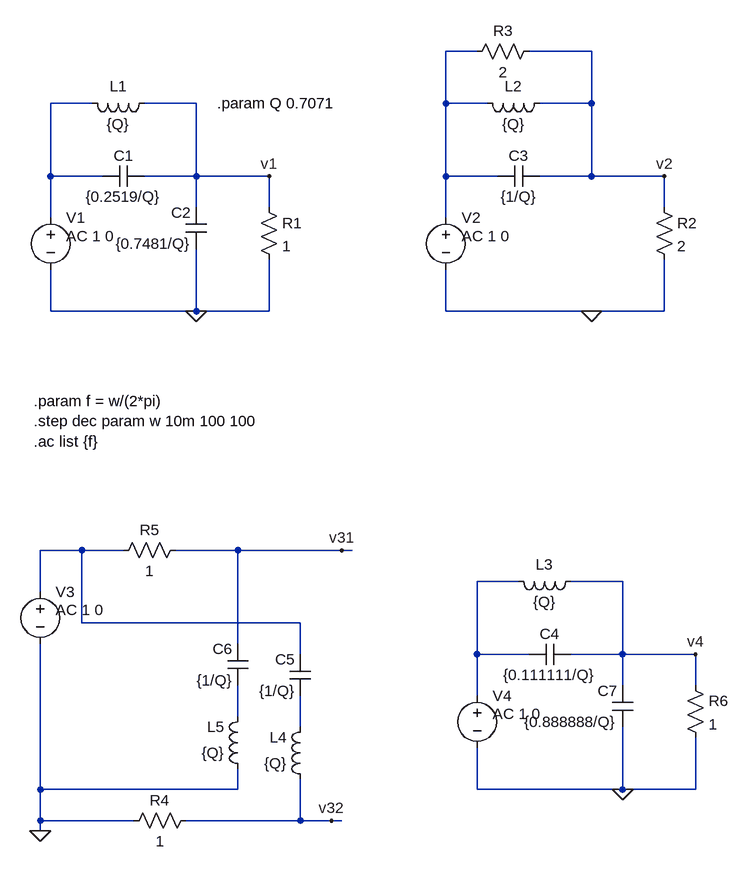
[diagram p0: schematic 2.asc]
2.asc, the LTspice schematic file:
Version 4
SHEET 1 1196 1108
WIRE -96 -976 -144 -976
WIRE 80 -976 -16 -976
WIRE -688 -896 -752 -896
WIRE -528 -896 -608 -896
WIRE -144 -896 -144 -976
WIRE -80 -896 -144 -896
WIRE 80 -896 80 -976
WIRE 80 -896 0 -896
WIRE -752 -784 -752 -896
WIRE -672 -784 -752 -784
WIRE -528 -784 -528 -896
WIRE -528 -784 -608 -784
WIRE -416 -784 -528 -784
WIRE -144 -784 -144 -896
WIRE -64 -784 -144 -784
WIRE 80 -784 80 -896
WIRE 80 -784 0 -784
WIRE 192 -784 80 -784
WIRE -528 -736 -528 -784
WIRE -416 -736 -416 -784
WIRE 192 -736 192 -784
WIRE -752 -720 -752 -784
WIRE -144 -720 -144 -784
WIRE -752 -576 -752 -640
WIRE -528 -576 -528 -672
WIRE -528 -576 -752 -576
WIRE -416 -576 -416 -656
WIRE -416 -576 -528 -576
WIRE -144 -576 -144 -640
WIRE 80 -576 -144 -576
WIRE 192 -576 192 -656
WIRE 192 -576 80 -576
WIRE -704 -208 -768 -208
WIRE -640 -208 -704 -208
WIRE -464 -208 -560 -208
WIRE -304 -208 -464 -208
WIRE -288 -208 -304 -208
WIRE -32 -160 -96 -160
WIRE 128 -160 48 -160
WIRE -768 -144 -768 -208
WIRE -704 -96 -704 -208
WIRE -368 -96 -704 -96
WIRE -464 -64 -464 -208
WIRE -368 -48 -368 -96
WIRE -96 -48 -96 -160
WIRE -16 -48 -96 -48
WIRE 128 -48 128 -160
WIRE 128 -48 48 -48
WIRE 240 -48 128 -48
WIRE 128 0 128 -48
WIRE 240 0 240 -48
WIRE -96 16 -96 -48
WIRE -464 48 -464 0
WIRE -368 64 -368 16
WIRE -768 160 -768 -64
WIRE -464 160 -464 128
WIRE -464 160 -768 160
WIRE -96 160 -96 96
WIRE 128 160 128 64
WIRE 128 160 -96 160
WIRE 240 160 240 80
WIRE 240 160 128 160
WIRE -768 208 -768 160
WIRE -624 208 -768 208
WIRE -368 208 -368 144
WIRE -368 208 -544 208
WIRE -320 208 -368 208
WIRE -304 208 -320 208
WIRE -768 224 -768 208
FLAG -528 -576 0
FLAG 80 -576 0
FLAG -768 224 0
FLAG 128 160 0
FLAG -416 -784 v1
FLAG 192 -784 v2
FLAG -304 -208 v31
FLAG 240 -48 v4
FLAG -320 208 v32
SYMBOL voltage -752 -736 R0
WINDOW 123 24 44 Left 2
WINDOW 39 0 0 Left 0
SYMATTR InstName V1
SYMATTR Value ""
SYMATTR Value2 AC 1 0
SYMBOL cap -608 -800 R90
WINDOW 0 0 32 VBottom 2
WINDOW 3 32 32 VTop 2
SYMATTR InstName C1
SYMATTR Value {0.2519/Q}
SYMBOL cap -512 -672 R180
WINDOW 0 24 56 Left 2
WINDOW 3 24 8 Left 2
SYMATTR InstName C2
SYMATTR Value {0.7481/Q}
SYMBOL res -432 -752 R0
SYMATTR InstName R1
SYMATTR Value 1
SYMBOL ind -592 -912 R90
WINDOW 0 5 56 VBottom 2
WINDOW 3 32 56 VTop 2
SYMATTR InstName L1
SYMATTR Value {Q}
SYMBOL voltage -144 -736 R0
WINDOW 123 24 44 Left 2
WINDOW 39 0 0 Left 0
SYMATTR InstName V2
SYMATTR Value ""
SYMATTR Value2 AC 1 0
SYMBOL cap 0 -800 R90
WINDOW 0 0 32 VBottom 2
WINDOW 3 32 32 VTop 2
SYMATTR InstName C3
SYMATTR Value {1/Q}
SYMBOL res 176 -752 R0
SYMATTR InstName R2
SYMATTR Value 2
SYMBOL ind 16 -912 R90
WINDOW 0 5 56 VBottom 2
WINDOW 3 32 56 VTop 2
SYMATTR InstName L2
SYMATTR Value {Q}
SYMBOL res 0 -992 R90
WINDOW 0 0 56 VBottom 2
WINDOW 3 32 56 VTop 2
SYMATTR InstName R3
SYMATTR Value 2
SYMBOL voltage -768 -160 R0
WINDOW 123 24 44 Left 2
WINDOW 39 0 0 Left 0
SYMATTR InstName V3
SYMATTR Value ""
SYMATTR Value2 AC 1 0
SYMBOL cap -352 16 R180
WINDOW 0 24 56 Left 2
WINDOW 3 24 8 Left 2
SYMATTR InstName C5
SYMATTR Value {1/Q}
SYMBOL ind -352 160 R180
WINDOW 0 36 80 Left 2
WINDOW 3 36 40 Left 2
SYMATTR InstName L4
SYMATTR Value {Q}
SYMBOL res -528 192 R90
WINDOW 0 0 56 VBottom 2
WINDOW 3 32 56 VTop 2
SYMATTR InstName R4
SYMATTR Value 1
SYMBOL cap -448 0 R180
WINDOW 0 24 56 Left 2
WINDOW 3 24 8 Left 2
SYMATTR InstName C6
SYMATTR Value {1/Q}
SYMBOL ind -448 144 R180
WINDOW 0 36 80 Left 2
WINDOW 3 36 40 Left 2
SYMATTR InstName L5
SYMATTR Value {Q}
SYMBOL res -544 -224 R90
WINDOW 0 0 56 VBottom 2
WINDOW 3 32 56 VTop 2
SYMATTR InstName R5
SYMATTR Value 1
SYMBOL voltage -96 0 R0
WINDOW 123 24 44 Left 2
WINDOW 39 0 0 Left 0
SYMATTR InstName V4
SYMATTR Value ""
SYMATTR Value2 AC 1 0
SYMBOL cap 48 -64 R90
WINDOW 0 0 32 VBottom 2
WINDOW 3 32 32 VTop 2
SYMATTR InstName C4
SYMATTR Value {0.111111/Q}
SYMBOL cap 144 64 R180
WINDOW 0 24 56 Left 2
WINDOW 3 24 8 Left 2
SYMATTR InstName C7
SYMATTR Value {0.888888/Q}
SYMBOL res 224 -16 R0
SYMATTR InstName R6
SYMATTR Value 1
SYMBOL ind 64 -176 R90
WINDOW 0 5 56 VBottom 2
WINDOW 3 32 56 VTop 2
SYMATTR InstName L3
SYMATTR Value {Q}
TEXT -496 -896 Left 2 !.param Q 0.7071
TEXT -778 -438 Left 2 !.param f = w/(2*pi)\n.step dec param w 10m 100 100\n.ac list {f}

The netlist it stands for:
* 2.asc
V1 N002 0 AC 1 0
C1 v1 N002 {0.2519/Q}
C2 0 v1 {0.7481/Q}
R1 v1 0 1
L1 v1 N002 {Q}
V2 N001 0 AC 1 0
C3 v2 N001 {1/Q}
R2 v2 0 2
L2 v2 N001 {Q}
R3 v2 N001 2
V3 N003 0 AC 1 0
C5 N006 N003 {1/Q}
L4 v32 N006 {Q}
R4 v32 0 1
C6 N005 v31 {1/Q}
L5 0 N005 {Q}
R5 v31 N003 1
V4 N004 0 AC 1 0
C4 v4 N004 {0.111111/Q}
C7 0 v4 {0.888888/Q}
R6 v4 0 1
L3 v4 N004 {Q}
.param Q 0.7071
.param f = w/(2*pi)
.step dec param w 10m 100 100
.ac list {f}
.backanno
.end